# EasyEDA schematic SCH_RAM-Module-Dual-IS66-DDR4_2026-05-29.json
TITLE: Sheet_1; REV: 1.0; Date: 2025-05-03; Sheet: 1/1; Drawn By: rezafouladian; Company: Your Company
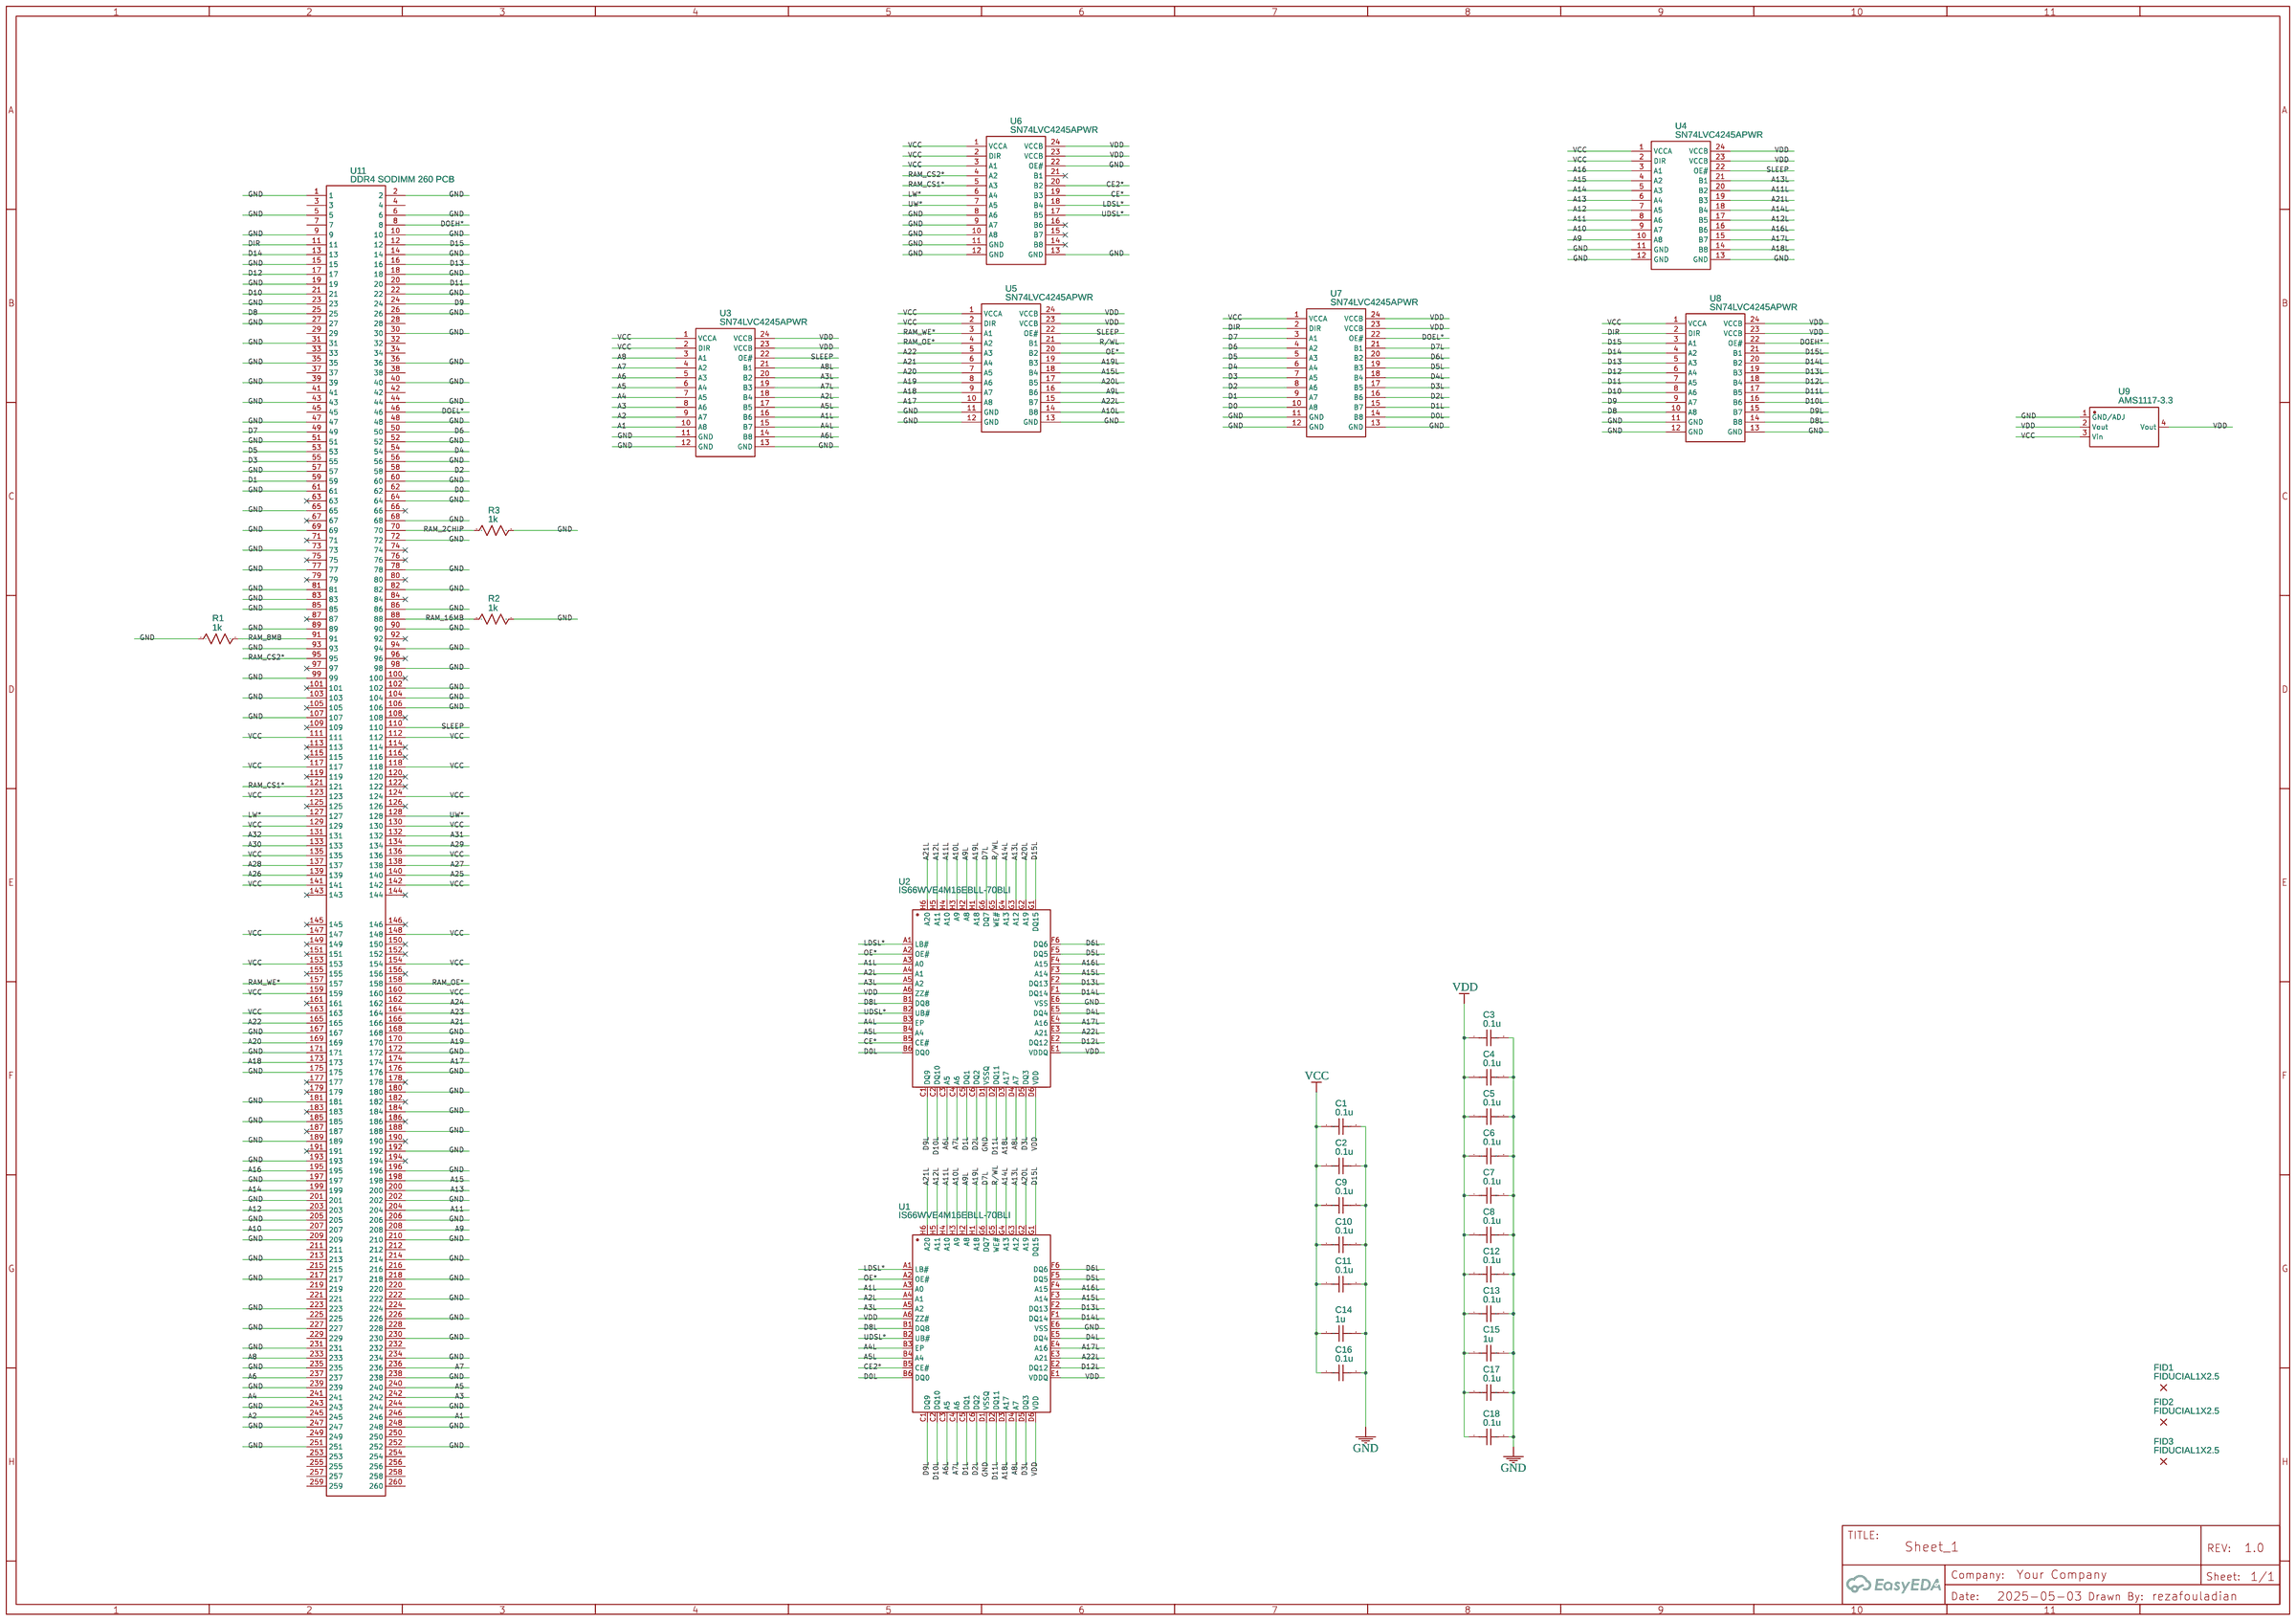
[diagram p0: schematic sheet]

## Parts
C1  0.1u  [C0402]
C2  0.1u  [C0402]
C3  0.1u  [C0402]
C4  0.1u  [C0402]
C5  0.1u  [C0402]
C6  0.1u  [C0402]
C7  0.1u  [C0402]
C8  0.1u  [C0402]
C9  0.1u  [C0402]
C10  0.1u  [C0402]
C11  0.1u  [C0402]
C12  0.1u  [C0402]
C13  0.1u  [C0402]
C14  1u  [C0805]
C15  1u  [C0805]
C16  0.1u  [C0402]
C17  0.1u  [C0402]
C18  0.1u  [C0402]
FID1  FIDUCIAL1X2.5  [FIDUCIAL-1X2.5]
FID2  FIDUCIAL1X2.5  [FIDUCIAL-1X2.5]
FID3  FIDUCIAL1X2.5  [FIDUCIAL-1X2.5]
R1  1k  [R0402]
R2  1k  [R0402]
R3  1k  [R0402]
U1  IS66WVE4M16EBLL-70BLI  [TFBGA-48_L8.0-W6.0-R8-C6-P0.75-TL]
U2  IS66WVE4M16EBLL-70BLI  [TFBGA-48_L8.0-W6.0-R8-C6-P0.75-TL]
U3  SN74LVC4245APWR  [TSSOP-24_L7.8-W4.4-P0.65-LS6.4-BL]
U4  SN74LVC4245APWR  [TSSOP-24_L7.8-W4.4-P0.65-LS6.4-BL]
U5  SN74LVC4245APWR  [TSSOP-24_L7.8-W4.4-P0.65-LS6.4-BL]
U6  SN74LVC4245APWR  [TSSOP-24_L7.8-W4.4-P0.65-LS6.4-BL]
U7  SN74LVC4245APWR  [TSSOP-24_L7.8-W4.4-P0.65-LS6.4-BL]
U8  SN74LVC4245APWR  [TSSOP-24_L7.8-W4.4-P0.65-LS6.4-BL]
U9  AMS1117-3.3  [SOT-223-3_L6.5-W3.4-P2.30-LS7.0-BR]
U11  DDR4 SODIMM 260 PCB  [DDDR4 SODIMM PCB]

## Library data of the parts
C1-C13 C16-C18 = C_0402_US: Contributor: LCEDA_Lib
C14 C15 = C_0805_US: Contributor: LCEDA_Lib
FID1-FID3 = FIDUCIAL1X2.5: Contributor: rezafouladian
R1-R3 = R_0402_US: Contributor: LCEDA_Lib
U1 U2 = IS66WVE4M16EBLL-70BLI: Supplier: LCSC; Supplier Part: C1350157; Manufacturer: ISSI(美国芯成); JLCPCB Part Class: Extended Part; Contributor: LCSC
U3-U8 = SN74LVC4245APWR: Supplier: LCSC; Manufacturer: TI(德州仪器); Supplier Part: C7859; JLCPCB Part Class: Basic Part
U9 = AMS1117-3.3: sourceId: dwIGgezVh; Supplier: LCSC; Manufacturer: AMS; Supplier Part: C6186; JLCPCB Part Class: Basic Part
U11 = DDR4 SODIMM 260 PCB: Contributor: rezafouladian; Manufacturer Part: DDR4_SODIMM_260; JLCPCB Part Class: Extended Part

## Nets
GND: C1.2 C2.2 C3.2 C4.2 C5.2 C6.2 C7.2 C8.2 C9.2 C10.2 C11.2 C12.2 C13.2 C14.2 C15.2 C16.2 C17.2 C18.2 R1.1 R2.2 R3.2 U1.D1(VSSQ) U1.E6(VSS) U2.D1(VSSQ) U2.E6(VSS) U3.11(GND) U3.12(GND) U3.13(GND) U4.11(GND) U4.12(GND) U4.13(GND) U5.11(GND) U5.12(GND) U5.13(GND) U6.8(A6) U6.9(A7) U6.10(A8) U6.11(GND) U6.12(GND) U6.13(GND) U6.22(OE#) U7.11(GND) U7.12(GND) U7.13(GND) U8.11(GND) U8.12(GND) U8.13(GND) U9.1(GND/ADJ) U11.1 U11.2 U11.5 U11.6 U11.9 U11.10 U11.14 U11.15 U11.18 U11.19 U11.22 U11.23 U11.26 U11.27 U11.30 U11.31 U11.35 U11.36 U11.39 U11.40 U11.43 U11.44 U11.47 U11.48 U11.51 U11.52 U11.56 U11.57 U11.60 U11.61 U11.64 U11.65 U11.68 U11.69 U11.72 U11.73 U11.77 U11.78 U11.81 U11.82 U11.83 U11.85 U11.86 U11.89 U11.90 U11.93 U11.94 U11.98 U11.99 U11.102 U11.103 U11.104 U11.106 U11.107 U11.167 U11.168 U11.171 U11.172 U11.175 U11.176 U11.180 U11.181 U11.184 U11.185 U11.188 U11.189 U11.192 U11.193 U11.196 U11.197 U11.201 U11.202 U11.205 U11.206 U11.209 U11.210 U11.213 U11.214 U11.217 U11.218 U11.222 U11.223 U11.226 U11.227 U11.230 U11.231 U11.234 U11.235 U11.238 U11.239 U11.243 U11.244 U11.247 U11.248 U11.251 U11.252
VCC: C1.1 C2.1 C9.1 C10.1 C11.1 C14.1 C16.1 U3.1(VCCA) U3.2(DIR) U4.1(VCCA) U4.2(DIR) U5.1(VCCA) U5.2(DIR) U6.1(VCCA) U6.2(DIR) U6.3(A1) U7.1(VCCA) U8.1(VCCA) U9.3(Vin) U11.111 U11.112 U11.117 U11.118 U11.123 U11.124 U11.129 U11.130 U11.135 U11.136 U11.141 U11.142 U11.147 U11.148 U11.153 U11.154 U11.159 U11.160 U11.163
VDD: C3.1 C4.1 C5.1 C6.1 C7.1 C8.1 C12.1 C13.1 C15.1 C17.1 C18.1 U1.A6(ZZ#) U1.D6(VDD) U1.E1(VDDQ) U2.A6(ZZ#) U2.D6(VDD) U2.E1(VDDQ) U3.23(VCCB) U3.24(VCCB) U4.23(VCCB) U4.24(VCCB) U5.23(VCCB) U5.24(VCCB) U6.23(VCCB) U6.24(VCCB) U7.23(VCCB) U7.24(VCCB) U8.23(VCCB) U8.24(VCCB) U9.2(Vout) U9.4(Vout)
A1: U3.10(A8) U11.246
A1L: U1.A3(A0) U2.A3(A0) U3.16(B6)
A2: U3.9(A7) U11.245
A2L: U1.A4(A1) U2.A4(A1) U3.18(B4)
A3: U3.8(A6) U11.242
A3L: U1.A5(A2) U2.A5(A2) U3.20(B2)
A4: U3.7(A5) U11.241
A4L: U1.B3(EP) U2.B3(EP) U3.15(B7)
A5: U3.6(A4) U11.240
A5L: U1.B4(A4) U2.B4(A4) U3.17(B5)
A6: U3.5(A3) U11.237
A6L: U1.C3(A5) U2.C3(A5) U3.14(B8)
A7: U3.4(A2) U11.236
A7L: U1.C4(A6) U2.C4(A6) U3.19(B3)
A8: U3.3(A1) U11.233
A8L: U1.D4(A7) U2.D4(A7) U3.21(B1)
A9: U4.10(A8) U11.208
A9L: U1.H2(A8) U2.H2(A8) U5.16(B6)
A10: U4.9(A7) U11.207
A10L: U1.H3(A9) U2.H3(A9) U5.14(B8)
A11: U4.8(A6) U11.204
A11L: U1.H4(A10) U2.H4(A10) U4.20(B2)
A12: U4.7(A5) U11.203
A12L: U1.H5(A11) U2.H5(A11) U4.17(B5)
A13: U4.6(A4) U11.200
A13L: U1.G3(A12) U2.G3(A12) U4.21(B1)
A14: U4.5(A3) U11.199
A14L: U1.G4(A13) U2.G4(A13) U4.18(B4)
A15: U4.4(A2) U11.198
A15L: U1.F3(A14) U2.F3(A14) U5.18(B4)
A16: U4.3(A1) U11.195
A16L: U1.F4(A15) U2.F4(A15) U4.16(B6)
A17: U5.10(A8) U11.174
A17L: U1.E4(A16) U2.E4(A16) U4.15(B7)
A18: U5.9(A7) U11.173
A18L: U1.D3(A17) U2.D3(A17) U4.14(B8)
A19: U5.8(A6) U11.170
A19L: U1.H1(A18) U2.H1(A18) U5.19(B3)
A20: U5.7(A5) U11.169
A20L: U1.G2(A19) U2.G2(A19) U5.17(B5)
A21: U5.6(A4) U11.166
A21L: U1.H6(A20) U2.H6(A20) U4.19(B3)
A22: U5.5(A3) U11.165
A22L: U1.E3(A21) U2.E3(A21) U5.15(B7)
A23: U11.164
A24: U11.162
A25: U11.140
A26: U11.139
A27: U11.138
A28: U11.137
A29: U11.134
A30: U11.133
A31: U11.132
A32: U11.131
CE2*: U1.B5(CE#) U6.20(B2)
CE*: U2.B5(CE#) U6.19(B3)
D0: U7.10(A8) U11.62
D0L: U1.B6(DQ0) U2.B6(DQ0) U7.14(B8)
D1: U7.9(A7) U11.59
D1L: U1.C5(DQ1) U2.C5(DQ1) U7.15(B7)
D2: U7.8(A6) U11.58
D2L: U1.C6(DQ2) U2.C6(DQ2) U7.16(B6)
D3: U7.7(A5) U11.55
D3L: U1.D5(DQ3) U2.D5(DQ3) U7.17(B5)
D4: U7.6(A4) U11.54
D4L: U1.E5(DQ4) U2.E5(DQ4) U7.18(B4)
D5: U7.5(A3) U11.53
D5L: U1.F5(DQ5) U2.F5(DQ5) U7.19(B3)
D6: U7.4(A2) U11.50
D6L: U1.F6(DQ6) U2.F6(DQ6) U7.20(B2)
D7: U7.3(A1) U11.49
D7L: U1.G6(DQ7) U2.G6(DQ7) U7.21(B1)
D8: U8.10(A8) U11.25
D8L: U1.B1(DQ8) U2.B1(DQ8) U8.14(B8)
D9: U8.9(A7) U11.24
D9L: U1.C1(DQ9) U2.C1(DQ9) U8.15(B7)
D10: U8.8(A6) U11.21
D10L: U1.C2(DQ10) U2.C2(DQ10) U8.16(B6)
D11: U8.7(A5) U11.20
D11L: U1.D2(DQ11) U2.D2(DQ11) U8.17(B5)
D12: U8.6(A4) U11.17
D12L: U1.E2(DQ12) U2.E2(DQ12) U8.18(B4)
D13: U8.5(A3) U11.16
D13L: U1.F2(DQ13) U2.F2(DQ13) U8.19(B3)
D14: U8.4(A2) U11.13
D14L: U1.F1(DQ14) U2.F1(DQ14) U8.20(B2)
D15: U8.3(A1) U11.12
D15L: U1.G1(DQ15) U2.G1(DQ15) U8.21(B1)
DIR: U7.2(DIR) U8.2(DIR) U11.11
DOEH*: U8.22(OE#) U11.8
DOEL*: U7.22(OE#) U11.46
LDSL*: U1.A1(LB#) U2.A1(LB#) U6.18(B4)
LW*: U6.6(A4) U11.127
OE*: U1.A2(OE#) U2.A2(OE#) U5.20(B2)
R/WL: U1.G5(WE#) U2.G5(WE#) U5.21(B1)
RAM_2CHIP: R3.1 U11.70
RAM_8MB: R1.2 U11.91
RAM_16MB: R2.1 U11.88
RAM_CS1*: U6.5(A3) U11.121
RAM_CS2*: U6.4(A2) U11.95
RAM_OE*: U5.4(A2) U11.158
RAM_WE*: U5.3(A1) U11.157
SLEEP: U3.22(OE#) U4.22(OE#) U5.22(OE#) U11.110
UDSL*: U1.B2(UB#) U2.B2(UB#) U6.17(B5)
UW*: U6.7(A5) U11.128

Not connected (* = marked no-connect by the designer): U6 14(B8)* 15(B7)* 16(B6)* 21(B1)*; U11 3 4 7 28 29 32 33 34 37 38 41 42 45 63* 66* 67* 71* 74* 75* 76* 79* 80* 84* 87* 92* 96* 97* 100* 101* 105* 108* 109* 113* 114* 115* 116* 119* 120* 122* 125* 126* 143* 144* 145* 146* 149* 150* 151* 152* 155* 156* 161* 177* 178* 179* 182* 183* 186* 187* 190* 191* 194* 211 212 215 216 219 220 221 224 225 228 229 232 249 250 253 254 255 256 257 258 259 260
